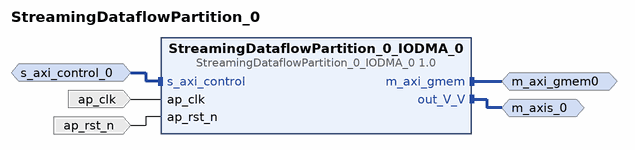
[diagram p0: block diagram of the top level]
# Vivado block design StreamingDataflowPartition_0, xc7z020clg400-1, Vivado 2020.1.1
create_bd_design StreamingDataflowPartition_0

create_bd_intf_port -mode Slave -vlnv xilinx.com:interface:aximm_rtl:1.0 s_axi_control_0
set_property -dict [list \
  CONFIG.DATA_WIDTH 32 \
  CONFIG.PROTOCOL AXI4LITE \
  CONFIG.FREQ_HZ 100000000.000000 \
  CONFIG.ID_WIDTH 0 \
  CONFIG.ADDR_WIDTH 6 \
  CONFIG.AWUSER_WIDTH 0 \
  CONFIG.ARUSER_WIDTH 0 \
  CONFIG.WUSER_WIDTH 0 \
  CONFIG.RUSER_WIDTH 0 \
  CONFIG.BUSER_WIDTH 0 \
  CONFIG.READ_WRITE_MODE READ_WRITE \
  CONFIG.HAS_BURST 0 \
  CONFIG.HAS_LOCK 0 \
  CONFIG.HAS_PROT 0 \
  CONFIG.HAS_CACHE 0 \
  CONFIG.HAS_QOS 0 \
  CONFIG.HAS_REGION 0 \
  CONFIG.HAS_WSTRB 1 \
  CONFIG.HAS_BRESP 1 \
  CONFIG.HAS_RRESP 1 \
  CONFIG.SUPPORTS_NARROW_BURST 0 \
  CONFIG.NUM_READ_OUTSTANDING 1 \
  CONFIG.NUM_WRITE_OUTSTANDING 1 \
  CONFIG.MAX_BURST_LENGTH 1 \
  CONFIG.NUM_READ_THREADS 1 \
  CONFIG.NUM_WRITE_THREADS 1 \
  CONFIG.RUSER_BITS_PER_BYTE 0 \
  CONFIG.WUSER_BITS_PER_BYTE 0 \
] [get_bd_intf_ports s_axi_control_0]
create_bd_intf_port -mode Master -vlnv xilinx.com:interface:aximm_rtl:1.0 m_axi_gmem0
set_property -dict [list \
  CONFIG.DATA_WIDTH 32 \
  CONFIG.PROTOCOL AXI4 \
  CONFIG.FREQ_HZ 100000000.000000 \
  CONFIG.ADDR_WIDTH 64 \
  CONFIG.HAS_BURST 0 \
  CONFIG.NUM_READ_OUTSTANDING 16 \
  CONFIG.NUM_WRITE_OUTSTANDING 16 \
] [get_bd_intf_ports m_axi_gmem0]
create_bd_intf_port -mode Master -vlnv xilinx.com:interface:axis_rtl:1.0 m_axis_0
set_property -dict {CONFIG.FREQ_HZ 100000000.000000} [get_bd_intf_ports m_axis_0]
create_bd_port -dir I -type clk ap_clk
set_property -dict {CONFIG.FREQ_HZ 100000000.000000} [get_bd_ports ap_clk]
create_bd_port -dir I -type rst ap_rst_n

create_bd_cell -type ip -vlnv xilinx.com:hls:StreamingDataflowPartition_0_IODMA_0:1.0 StreamingDataflowPartition_0_IODMA_0

# ---- connections ----

connect_bd_intf_net [get_bd_intf_ports m_axi_gmem0] [get_bd_intf_pins StreamingDataflowPartition_0_IODMA_0/m_axi_gmem]
connect_bd_intf_net -intf_net s_axi_control_0_1 [get_bd_intf_ports s_axi_control_0] [get_bd_intf_pins StreamingDataflowPartition_0_IODMA_0/s_axi_control]
connect_bd_intf_net [get_bd_intf_ports m_axis_0] [get_bd_intf_pins StreamingDataflowPartition_0_IODMA_0/out_V_V]
connect_bd_net -net ap_clk_0_1 [get_bd_ports ap_clk] [get_bd_pins StreamingDataflowPartition_0_IODMA_0/ap_clk]
connect_bd_net -net ap_rst_n_0_1 [get_bd_ports ap_rst_n] [get_bd_pins StreamingDataflowPartition_0_IODMA_0/ap_rst_n]

validate_bd_design
save_bd_design
